# EAGLE design tl4242-driver-20mm-mk-2 (EAGLE 6.5.0)
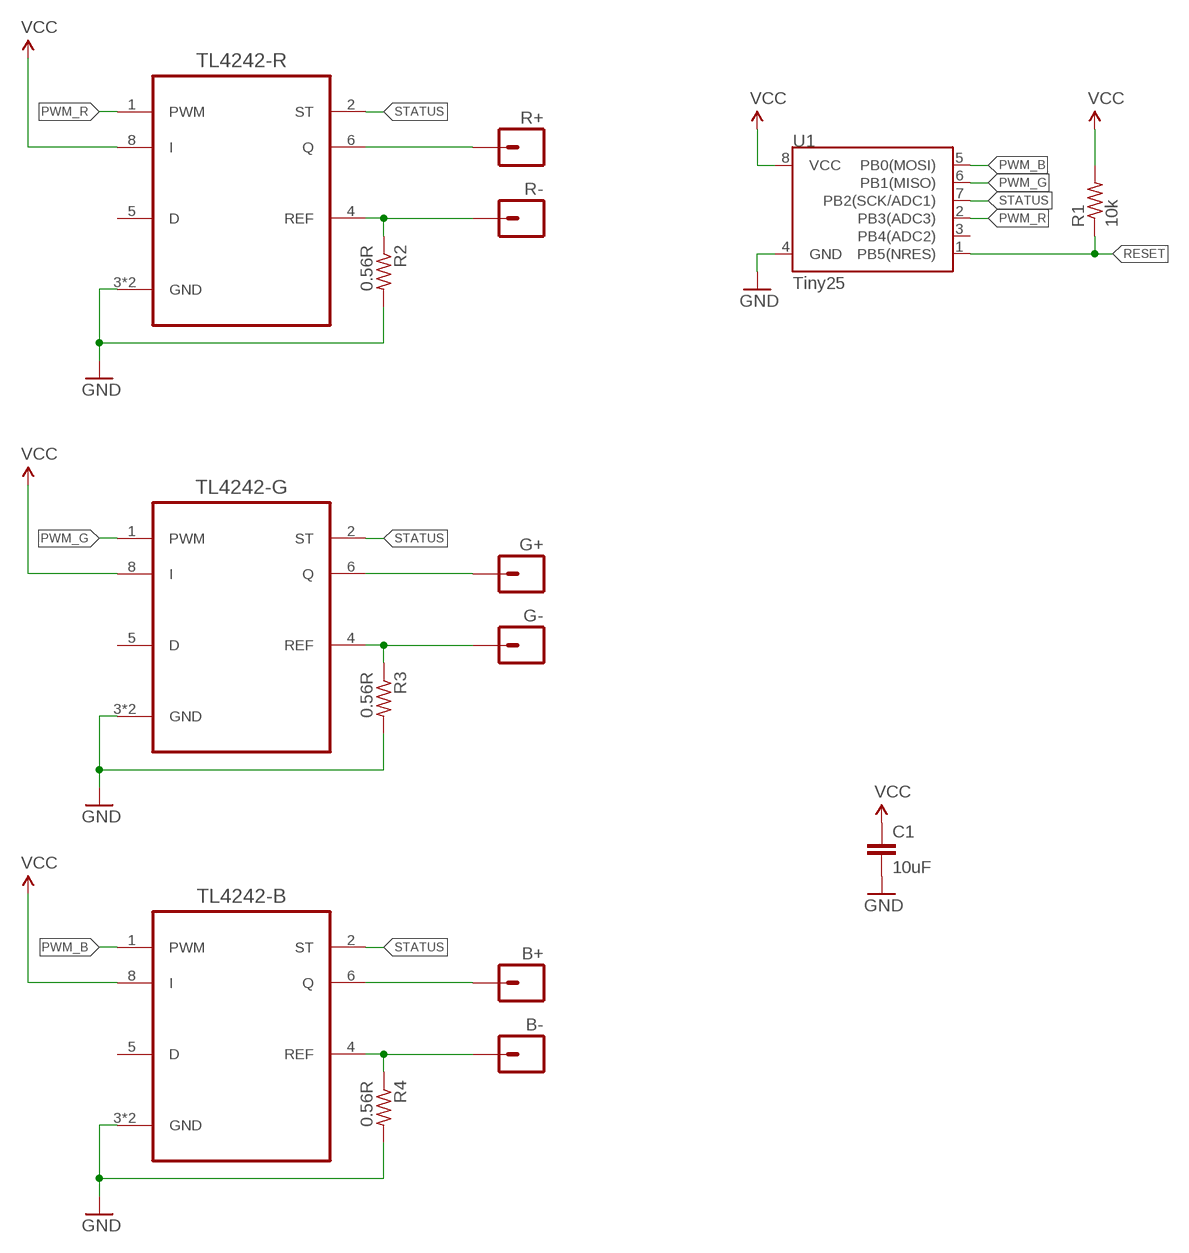
[diagram p0: schematic, sheet 1]

## Parts
B+  M01PTH-0.65MM-NS  [1X01_635UM]
B-  M01PTH-0.65MM-NS  [1X01_635UM]
C1  10uF  CAPACITOR-CERAMICC0805  [C0805]
G+  M01PTH-0.65MM-NS  [1X01_635UM]
G-  M01PTH-0.65MM-NS  [1X01_635UM]
R1  10k  RESISTORR0402  [R0402]
R2  0.56R  RESISTORR0805  [R0805]
R3  0.56R  RESISTORR0805  [R0805]
R4  0.56R  RESISTORR0805  [R0805]
R+  M01PTH-0.65MM-NS  [1X01_635UM]
R-  M01PTH-0.65MM-NS  [1X01_635UM]
TL4242-B  TL4242DRJRSON8  [SON80P410X410X80-9N]
TL4242-G  TL4242DRJRSON8  [SON80P410X410X80-9N]
TL4242-R  TL4242DRJRSON8  [SON80P410X410X80-9N]
U1  Tiny25  ATTINY45TINY25-20-SOICN  [SO08]

## Nets
GND: C1.2 R2.2 R3.2 R4.2 TL4242-B.3(GND) TL4242-B.9(GND) TL4242-G.3(GND) TL4242-G.9(GND) TL4242-R.3(GND) TL4242-R.9(GND) U1.4(GND)
N$1: G-.P$1 R3.1 TL4242-G.4(REF)
N$2: R2.1 R-.P$1 TL4242-R.4(REF)
N$3: R+.P$1 TL4242-R.6(Q)
N$4: G+.P$1 TL4242-G.6(Q)
N$5: B-.P$1 R4.1 TL4242-B.4(REF)
N$6: B+.P$1 TL4242-B.6(Q)
PWM_B: TL4242-B.1(PWM) U1.5(PB0(MOSI))
PWM_G: TL4242-G.1(PWM) U1.6(PB1(MISO))
PWM_R: TL4242-R.1(PWM) U1.2(PB3(ADC3))
RESET: R1.1 U1.1(PB5(NRES))
STATUS: TL4242-B.2(ST) TL4242-G.2(ST) TL4242-R.2(ST) U1.7(PB2(SCK/ADC1))
VCC: C1.1 R1.2 TL4242-B.8(I) TL4242-G.8(I) TL4242-R.8(I) U1.8(VCC)
Unconnected: TL4242-B.5(D) TL4242-G.5(D) TL4242-R.5(D) U1.3(PB4(ADC2))

## Library data of the parts
B+ B- G+ G- R+ R- = A_butts:M01: Header 1 Standard 1-pin 0.1" header. Use with straight break away headers (SKU : PRT-00116), right angle break away headers (PRT-00553), swiss pins (PRT-00743), machine pins (PRT-00117), and female headers (PRT-00115).
C1 = A_butts:CAPACITOR-CERAMIC: CAPACITOR, European symbol
R1-R4 = A_butts:RESISTOR: RESISTOR, American symbol
TL4242-B TL4242-G TL4242-R = A_butts:TL4242DRJR: ADJUSTABLE LED DRIVER; MPN: TL4242DRJR; OC_FARNELL: 1755246; OC_NEWARK: 94M9959; PACKAGE: SON-8; SUPPLIER: Texas Instruments
U1 = A_butts:ATTINY45: Atmel 8-pin 2/4/8kB flash uC

## Board
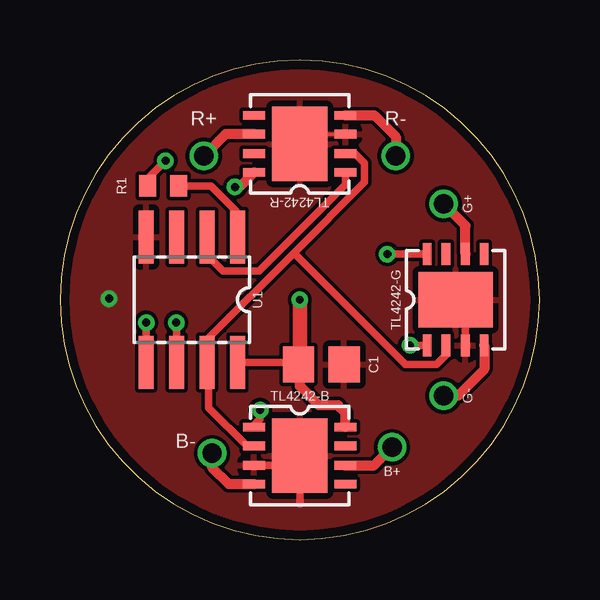
[diagram p1: board, top side]
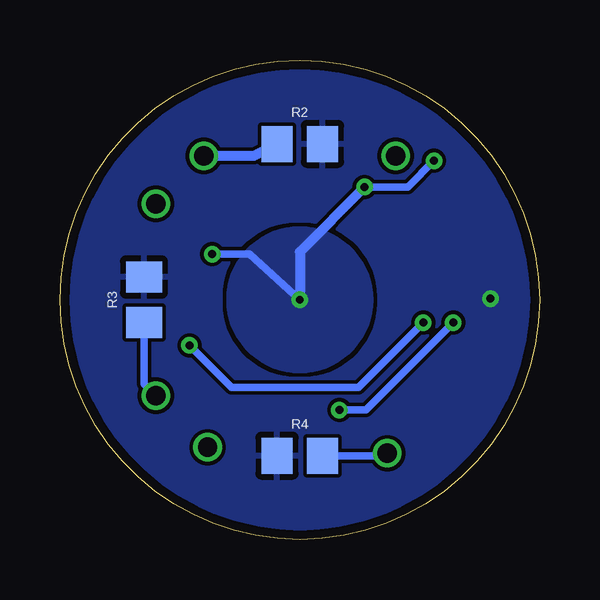
[diagram p2: board, bottom side, seen from below]

Size 20 x 20 mm. Coordinates in mm from the lower left corner, seen from the top.
Outline: 0,10 arc90 10,0 arc90 20,10 arc90 10,20 arc90 0,10
Copper layers (1*16): Top 0.0356mm / dielectric 1.5011mm / Bottom 0.0356mm
Design rules "LaenPCBOrder2": minimum track width 6mil, minimum drill 13mil, track to track 6mil, track to pad 6mil, pad to pad 6mil, via to via 6mil, smd to smd 6mil, copper to edge 15mil, drill to drill 6mil, minimum pad ring 7mil, minimum via ring 7mil, stop-mask expansion 3mil, vias tented up to drill 20mil, thermal gap 10mil

### Footprints (pad centres in the part's own frame; a part is rotated, then mirrored left to right if it is on the bottom)
1X01_635UM = drill 0.8: P$1 0,0
C0805 = smd 1.3 x 1.5: 1 -0.95,0; 2 0.95,0
R0402 = smd 0.7 x 0.9: 1 -0.65,0; 2 0.65,0
R0805 = smd 1.3 x 1.5: 1 -0.95,0; 2 0.95,0
SON80P410X410X80-9N = smd 0.914 x 0.356: 1 -1.905,1.194; 2 -1.905,0.406; 3 -1.905,-0.406; 4 -1.905,-1.194; 5 1.905,-1.194; 6 1.905,-0.406; 7 1.905,0.406; 8 1.905,1.194 | smd 2.311 x 3.099: 9 0,0
SO08 = smd 0.61 x 2.21: 1 -1.905,-2.616; 2 -0.635,-2.616; 3 0.635,-2.616; 4 1.905,-2.616; 5 1.905,2.616; 6 0.635,2.616; 7 -0.635,2.616; 8 -1.905,2.616

### Placement (x,y rotation side)
B+  13.85,3.85 180 top
B-  6.35,3.6 180 top
C1  10.9,7.3 0 top
G+  16,14 270 top
G-  16,6 270 top
R1  4.3,14.75 180 top
R2  10,16.5 0 bottom
R3  16.5,10 90 bottom
R4  10,3.5 180 bottom
R+  6,16 0 top
R-  14,16 0 top
TL4242-B  10,3.5 0 top
TL4242-G  16.5,10 90 top
TL4242-R  10,16.5 180 top
U1  5.5,10 180 top

### Tracks (layer width: path | path; a pad name or v marks a point on that pad's centre or on a via)
GND  (via drill 0.33)
  Top 0.152: TL4242-R.3 10.41,16.91 TL4242-R.9
  Top 0.305: 8.2,3.1 10,3.1 | 10,3.1 10,1.5 | 10,3.9 10,3.1 | TL4242-G.3 16.91,9.59 TL4242-G.9
  other vias: 2.05,10.05
  pour Top (rank 6): 10,0 arc-90 0,10 arc-90 10,20 arc-90 20,10 arc-90
  pour Bottom (rank 6): 10,0 arc-90 0,10 arc-90 10,20 arc-90 20,10 arc-90
N$1
  Top 0.406: TL4242-G.4 17.69,7.09 16.6,6 G-.P$1
  Bottom 0.305: R3.1 16.5,6.5 G-.P$1
N$2
  Top 0.406: TL4242-R.4 13.11,17.69 14,16.8 R-.P$1
  Bottom 0.406: R2.1 11.92,16 R-.P$1
N$3
  Top 0.406: TL4242-R.6 6.91,16.91 R+.P$1
N$4
  Top 0.406: TL4242-G.6 16.91,13.09 G+.P$1
N$5
  Top 0.406: TL4242-B.4 7.04,2.31 6.35,3 B-.P$1
  Bottom 0.305: R4.1 6.45,3.5 B-.P$1
N$6
  Top 0.406: TL4242-B.6 13.09,3.09 B+.P$1
PWM_B  (via drill 0.33)
  Top 0.152: U1.5 | 8.05,4.74 TL4242-B.1
  Top 0.305: U1.5 v3.6,9.05 | 8.05,4.74 8.35,5.04 v8.35,5.4
  Bottom 0.305: v3.6,9.05 7.25,5.4 v8.35,5.4
PWM_G  (via drill 0.33)
  Top 0.152: v4.85,9.05 4.87,9.04
  Top 0.305: v14.6,8.1 TL4242-G.1 | 4.87,9.04 U1.6
  Bottom 0.305: v14.6,8.1 12.85,6.35 7.55,6.35 v4.85,9.05
PWM_R
  Top 0.305: U1.2 6.13,11.87 6.8,11.2 8.3,11.2 11.9,14.8 TL4242-R.1
RESET
  Top 0.152: 7.41,11.61 U1.1 7.35,12.67 7.35,13.7
  Top 0.305: R1.1 6.3,14.75 7.35,13.7
STATUS
  Top 0.152: 6.2,7.32 U1.7
  Top 0.305: TL4242-B.2 7.79,3.91 6.2,5.5 6.2,7.32 | TL4242-R.2 12.31,16.09 12.7,15.7 12.7,14.9 9.75,11.95 | 9.75,11.95 6.13,8.34 U1.7 | TL4242-G.2 16.09,7.69 15.7,7.3 14.4,7.3 9.75,11.95
VCC  (via drill 0.33)
  Top 0.152: U1.8
  Top 0.305: v13.65,11.9 TL4242-G.8 | R1.2 3.65,15.05 v4.4,15.8 | U1.8 9.87,7.38 C1.1
  Top 0.406: TL4242-R.8 7.49,14.7 v7.3,14.7 | TL4242-B.8 11.9,5.29 11.6,5.6 10.8,5.6 10,6.4 10,7.25 C1.1
  Top 0.61: v10,10 10,7.35 C1.1
  Bottom 0.305: v13.65,11.9 12.1,11.9 v10,10 | v7.3,14.7 5.5,14.7 v4.4,15.8
  Bottom 0.406: v7.3,14.7 10,12 v10,10
  pour Bottom: 7,10 arc90 10,7 arc90 13,10 arc90 10,13 arc90